# EAGLE schematic NGDash (EAGLE 9.2.1)

## Sheet 1 of 4
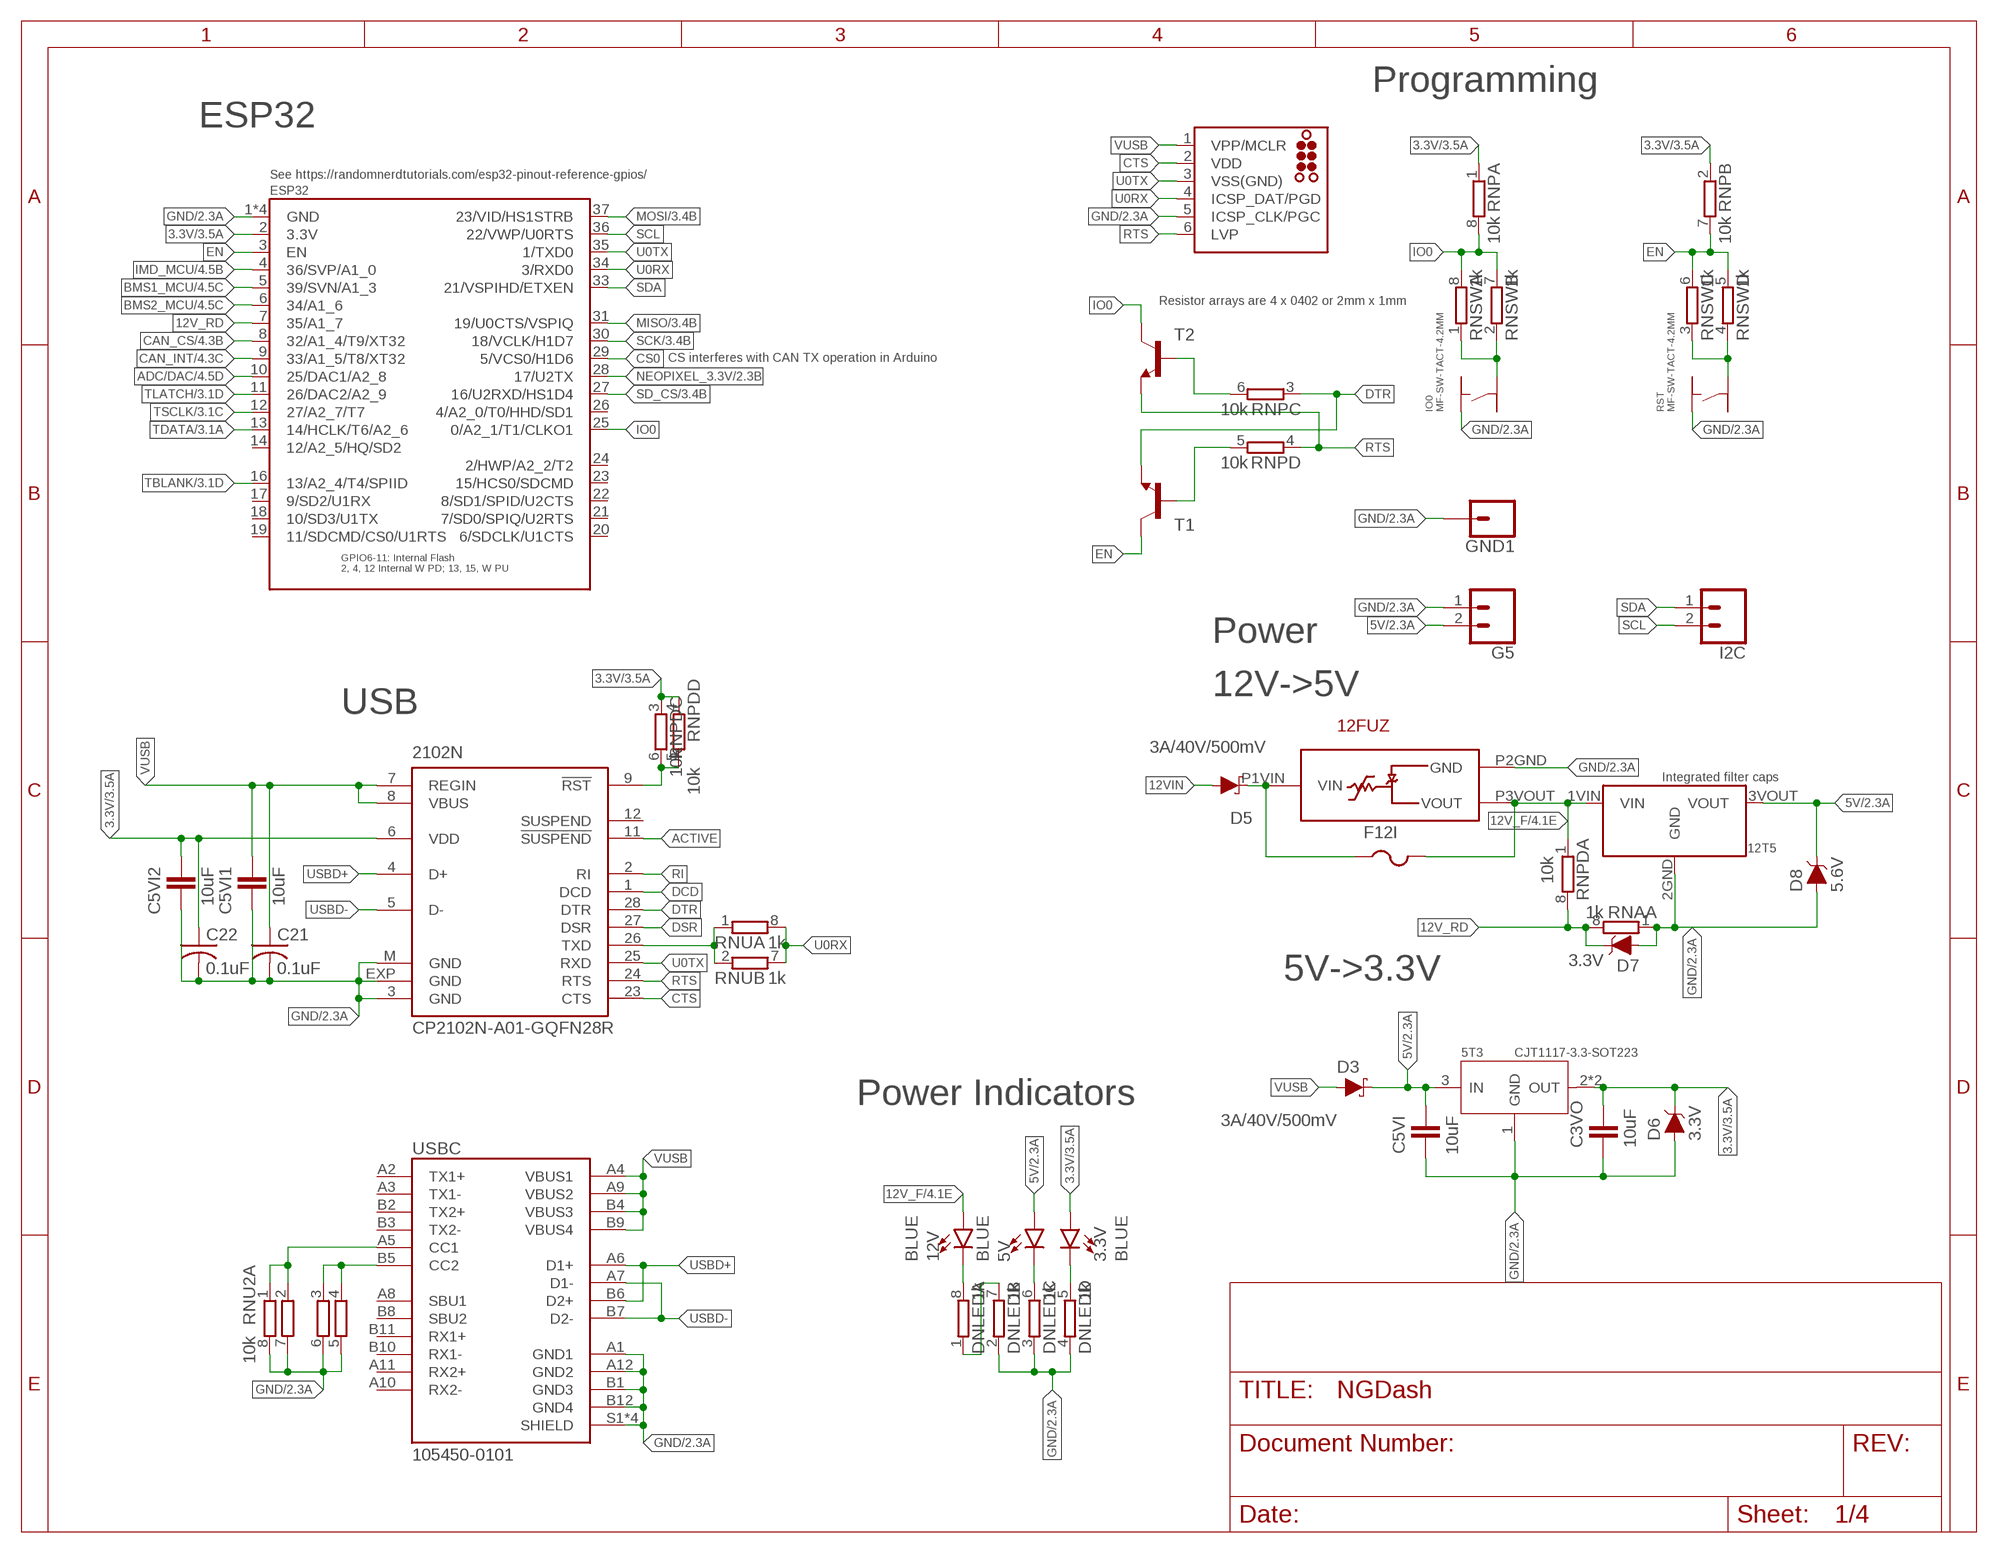
[diagram p0: schematic, sheet 1]

### Parts
3.3V  BLUE  LED-BLUE0603  [LED-0603]
5T3  CJT1117-3.3-SOT223  PMIC-CJT1117-3.3(SOT223)  [SOT-223]
5V  BLUE  LED-BLUE0603  [LED-0603]
12FUZ  LITTELFUSE-POLYZEN-ZEN164V130A24LS  [LITTELFUSE-POLYZEN-ZEN164V130A24LS]
12T5  TRACO-TSR-2-2450  [TRACO-TSR-2-2450]
12V  BLUE  LED-BLUE0603  [LED-0603]
2102N  CP2102N-A01-GQFN28R  CP2102  [MLP28]
C3VO  10uF  CAP1210  [1210]
C5VI  10uF  CAP1210  [1210]
C5VI1  10uF  CAP1210  [1210]
C5VI2  10uF  CAP1210  [1210]
C21  0.1uF  C-USC0603  [C0603]
C22  0.1uF  C-USC0603  [C0603]
D3  3A/40V/500mV  DIODE-SCHOTTKY-B340A  [SMA-DIODE]
D5  3A/40V/500mV  DIODE-SCHOTTKY-B340A  [SMA-DIODE]
D6  3.3V  DIODE-ZENER-MM3Z3V3T1G  [SOD-323]
D7  3.3V  DIODE-ZENER-MM3Z3V3T1G  [SOD-323]
D8  5.6V  DIODE-ZENER-MMSZ5232BS  [SOD-323]
DNLED  1k  4R-N0402ARV341  [4X0402ARV341]
ESP32  ESP32-WROOM-32  [ESP32-WROOM32]
F12I  PTCFUSE-1812  [1812]
G5  CONN_02  [1X02]
GND1  CONN_01  [1X01]
I2C  CONN_02  [1X02]
IO0  MF-SW-TACT-4.2MM  TACT_4.2MM  [TACT4.2MM]
J2  TC2030-MCP  [TC2030-MCP]
RNA  1k  4R-N0402ARV341  [4X0402ARV341]
RNP  10k  4R-N0402ARV341  [4X0402ARV341]
RNPD  10k  4R-N0402ARV341  [4X0402ARV341]
RNSW  1k  4R-N0402ARV341  [4X0402ARV341]
RNU  1k  4R-N0402ARV341  [4X0402ARV341]
RNU2  10k  4R-N0402ARV341  [4X0402ARV341]
RST  MF-SW-TACT-4.2MM  TACT_4.2MM  [TACT4.2MM]
T1  BC850-NPN-SOT23-BEC  [SOT23-BEC]
T2  BC850-NPN-SOT23-BEC  [SOT23-BEC]
USBC  105450-0101  [MOLEX_105450-0101]

### Nets
3.3V: 3.3V.A 5T3.2(OUT) 5T3.TER(OUT) 2102N.6(VDD) C3VO.1 C5VI2.1 C22.1 D6.C ESP32.2(3.3V) RNP.1 RNP.2 RNPD.3 RNPD.4 ; also sheet 3,4
5V: 5T3.3(IN) 5V.A 12T5.3VOUT(VOUT) C5VI.1 D3.C D8.C G5.2 ; also sheet 2,3,4
12V_F: 12FUZ.P3VOUT(VOUT) 12T5.1VIN(VIN) 12V.A F12I.2 RNPD.1 ; also sheet 4
12V_RD: D7.C ESP32.7(35/A1_7) RNA.8 RNPD.8
12VIN: D5.A ; also sheet 4
12VRECT: 12FUZ.P1VIN(VIN) D5.C F12I.1
ACTIVE: 2102N.11(!SUSPEND)
ADC/DAC: ESP32.10(25/DAC1/A2_8) ; also sheet 4
BMS1_MCU: ESP32.5(39/SVN/A1_3) ; also sheet 4
BMS2_MCU: ESP32.6(34/A1_6) ; also sheet 4
CAN_CS: ESP32.8(32/A1_4/T9/XT32) ; also sheet 4
CAN_INT: ESP32.9(33/A1_5/T8/XT32) ; also sheet 4
CS0: ESP32.29(5/VCS0/H1D6)
CTS: 2102N.23(CTS) J2.2(VDD)
DCD: 2102N.1(DCD)
DSR: 2102N.27(DSR)
DTR: 2102N.28(DTR) RNP.3 T1.E
EN: ESP32.3(EN) RNP.7 RNSW.5 RNSW.6 T1.C
GND: 5T3.1(GND) 12FUZ.P2GND(GND) 12T5.2GND(GND) 2102N.3(GND) 2102N.EXP(GND) 2102N.M(GND) C3VO.2 C5VI1.2 C5VI2.2 C5VI.2 C21.2 C22.2 D6.A D7.A D8.A DNLED.2 DNLED.3 DNLED.4 ESP32.1(GND) ESP32.15(GND) ESP32.38(GND) ESP32.GND G5.1 GND1.1 IO0.P$1 J2.5(ICSP_CLK/PGC) RNA.1 RNU2.5 RNU2.6 RNU2.7 RNU2.8 RST.P$1 USBC.A1(GND1) USBC.A12(GND2) USBC.B1(GND3) USBC.B12(GND4) USBC.S1(SHIELD) USBC.S2(SHIELD) USBC.S3(SHIELD) USBC.S4(SHIELD) ; also sheet 2,3,4
IMD_MCU: ESP32.4(36/SVP/A1_0) ; also sheet 4
IO0: ESP32.25(0/A2_1/T1/CLKO1) RNP.8 RNSW.7 RNSW.8 T2.C
MISO: ESP32.31(19/U0CTS/VSPIQ) ; also sheet 3,4
MOSI: ESP32.37(23/VID/HS1STRB) ; also sheet 3,4
N$1: 5V.C DNLED.6
N$2: IO0.P$4 RNSW.1 RNSW.2
N$3: RNP.5 T1.B
N$4: RNP.6 T2.B
N$6: RNU2.1 RNU2.2 USBC.A5(CC1)
N$7: RNSW.3 RNSW.4 RST.P$4
N$9: 3.3V.C DNLED.5
N$18: 2102N.9(!RST) RNPD.5 RNPD.6
N$19: RNU2.3 RNU2.4 USBC.B5(CC2)
N$104: DNLED.1 DNLED.7
N$110: 12V.C DNLED.8
NEOPIXEL_3.3V: ESP32.28(17/U2TX) ; also sheet 2
RI: 2102N.2(RI)
RTS: 2102N.24(RTS) J2.6(LVP) RNP.4 T2.E
SCK: ESP32.30(18/VCLK/H1D7) ; also sheet 3,4
SCL: ESP32.36(22/VWP/U0RTS) I2C.2
SD_CS: ESP32.27(16/U2RXD/HS1D4) ; also sheet 3
SDA: ESP32.33(21/VSPIHD/ETXEN) I2C.1
TBLANK: ESP32.16(13/A2_4/T4/SPIID) ; also sheet 3
TDATA: ESP32.13(14/HCLK/T6/A2_6) ; also sheet 3
TLATCH: ESP32.11(26/DAC2/A2_9) ; also sheet 3
TSCLK: ESP32.12(27/A2_7/T7) ; also sheet 3
U0RX: ESP32.34(3/RXD0) J2.4(ICSP_DAT/PGD) RNU.7 RNU.8
U0TX: 2102N.25(RXD) ESP32.35(1/TXD0) J2.3(VSS(GND))
U0TXC: 2102N.26(TXD) RNU.1 RNU.2
USBD+: 2102N.4(D+) USBC.A6(D1+) USBC.B6(D2+)
USBD-: 2102N.5(D-) USBC.A7(D1-) USBC.B7(D2-)
VUSB: 2102N.7(REGIN) 2102N.8(VBUS) C5VI1.1 C21.1 D3.A J2.1(VPP/MCLR) USBC.A4(VBUS1) USBC.A9(VBUS2) USBC.B4(VBUS3) USBC.B9(VBUS4)
Unconnected: 2102N.12(SUSPEND) ESP32.14(12/A2_5/HQ/SD2) ESP32.17(9/SD2/U1RX) ESP32.18(10/SD3/U1TX) ESP32.19(11/SDCMD/CS0/U1RTS) ESP32.20(6/SDCLK/U1CTS) ESP32.21(7/SD0/SPIQ/U2RTS) ESP32.22(8/SD1/SPID/U2CTS) ESP32.23(15/HCS0/SDCMD) ESP32.24(2/HWP/A2_2/T2) ESP32.26(4/A2_0/T0/HHD/SD1) IO0.P$2 IO0.P$3 RNPD.2 RNPD.7 RST.P$2 RST.P$3 USBC.A2(TX1+) USBC.A3(TX1-) USBC.A8(SBU1) USBC.A10(RX2-) USBC.A11(RX2+) USBC.B2(TX2+) USBC.B3(TX2-) USBC.B8(SBU2) USBC.B10(RX1-) USBC.B11(RX1+)

### Notes on the sheet
- Programming
- ESP32
- See https://randomnerdtutorials.com/esp32-pinout-reference-gpios/
- Resistor arrays are 4 x 0402 or 2mm x 1mm
- CS interferes with CAN TX operation in Arduino
- Power
- 12V->5V
- USB
- Integrated filter caps
- 5V->3.3V
- Power Indicators

## Sheet 2 of 4
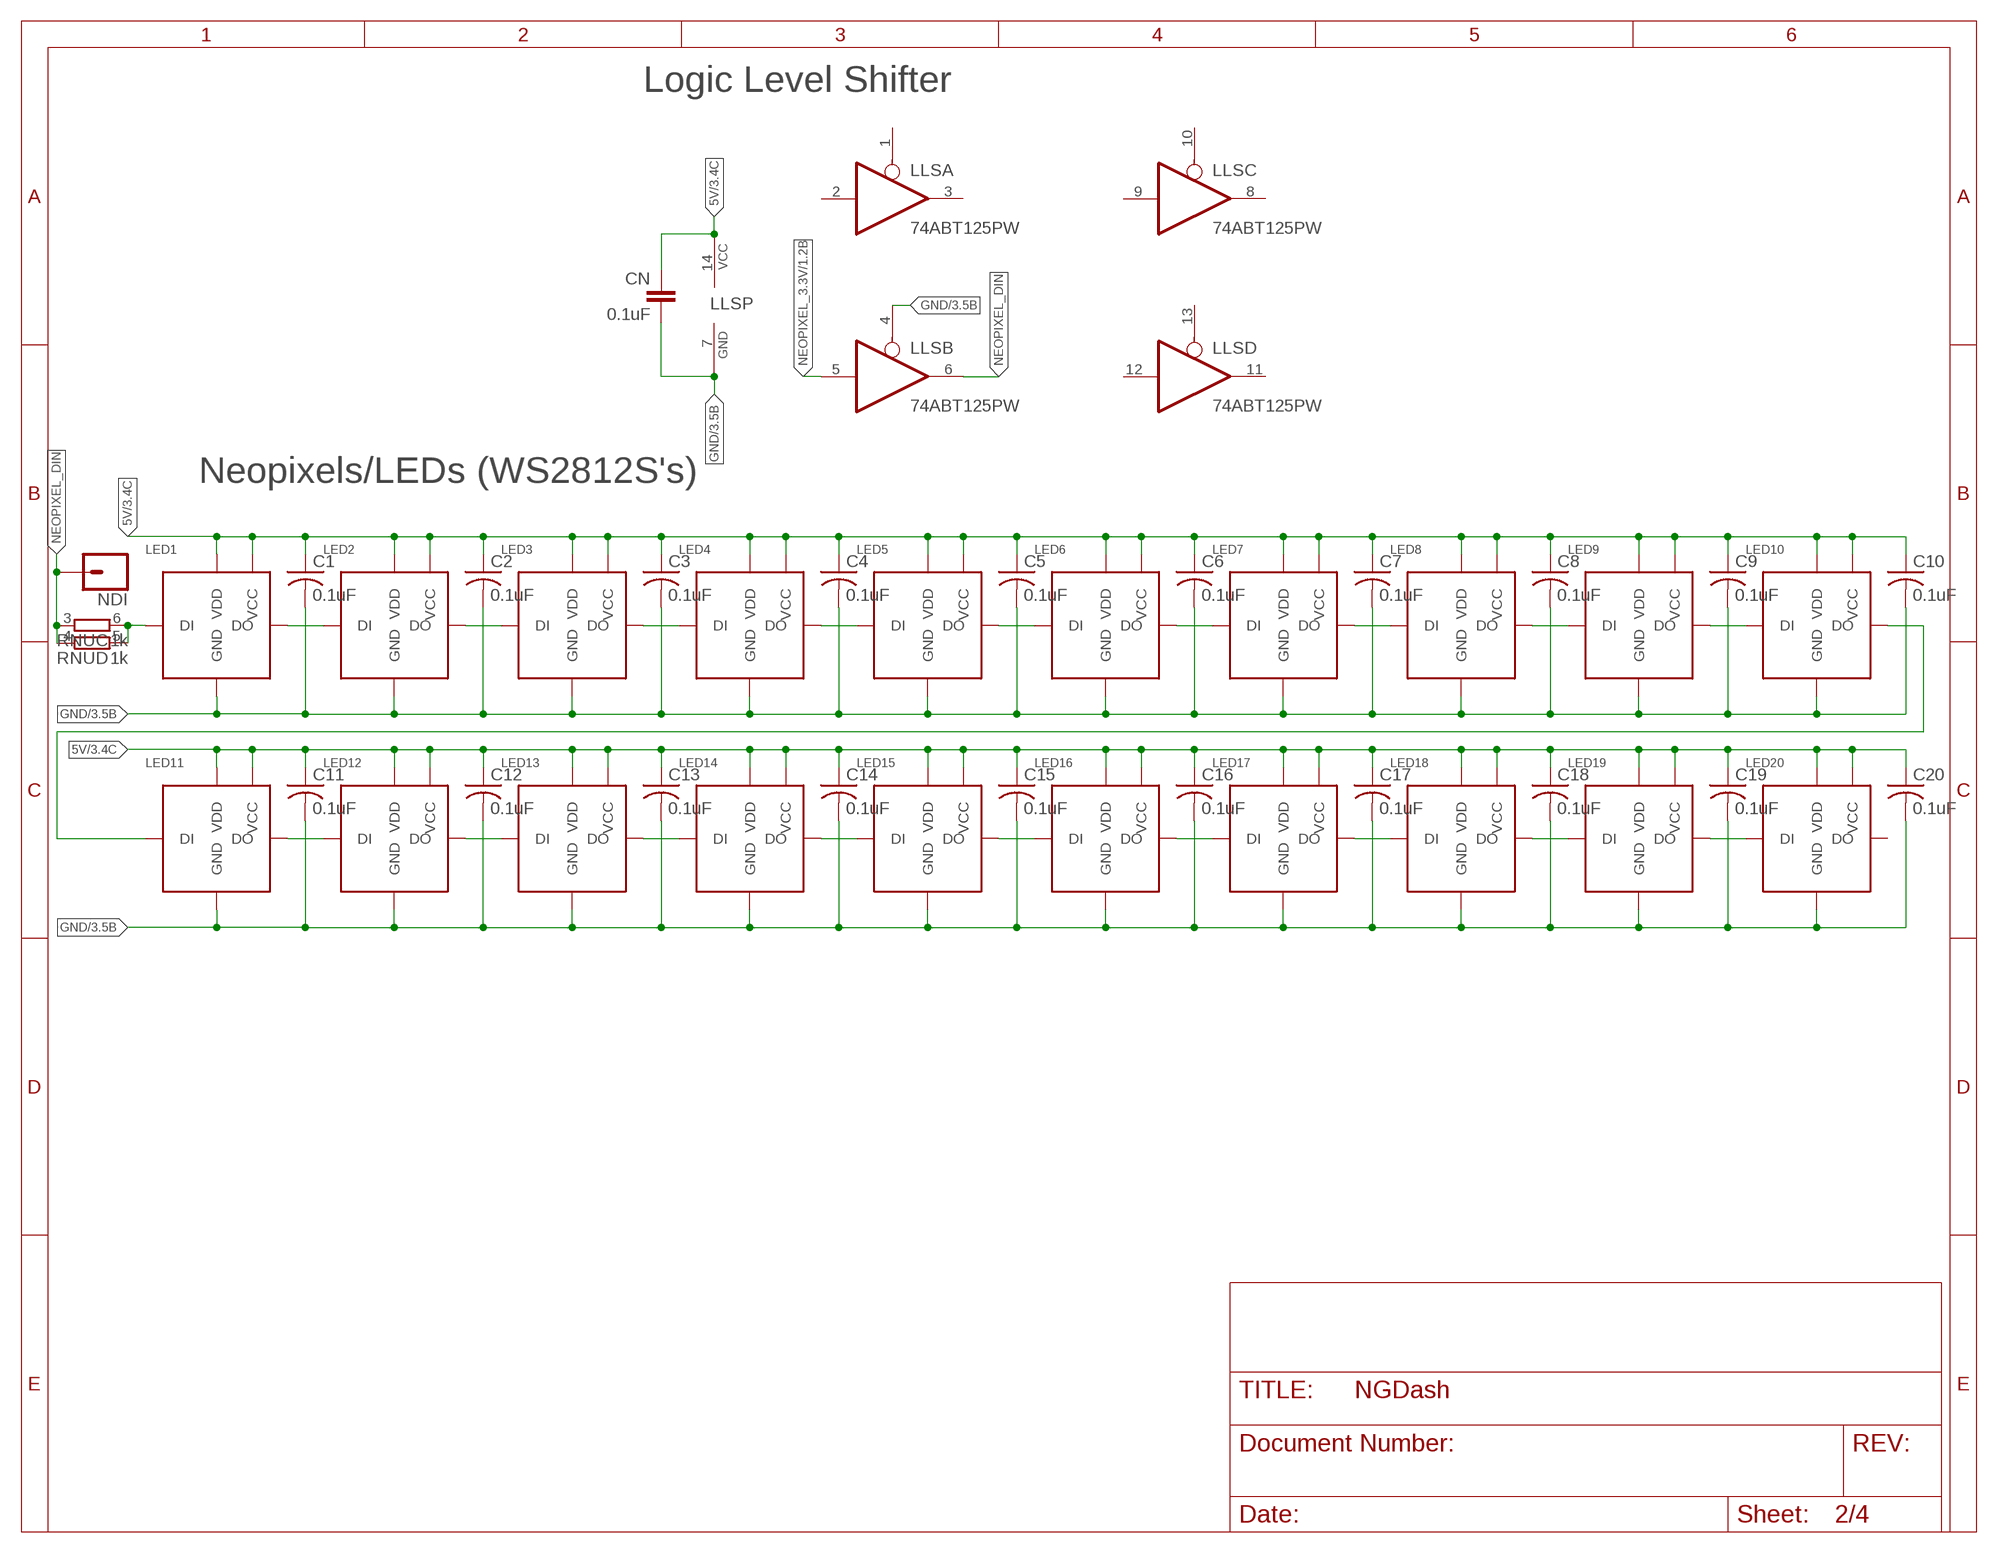
[diagram p1: schematic, sheet 2]

### Parts
C1  0.1uF  C-USC0603  [C0603]
C2  0.1uF  C-USC0603  [C0603]
C3  0.1uF  C-USC0603  [C0603]
C4  0.1uF  C-USC0603  [C0603]
C5  0.1uF  C-USC0603  [C0603]
C6  0.1uF  C-USC0603  [C0603]
C7  0.1uF  C-USC0603  [C0603]
C8  0.1uF  C-USC0603  [C0603]
C9  0.1uF  C-USC0603  [C0603]
C10  0.1uF  C-USC0603  [C0603]
C11  0.1uF  C-USC0603  [C0603]
C12  0.1uF  C-USC0603  [C0603]
C13  0.1uF  C-USC0603  [C0603]
C14  0.1uF  C-USC0603  [C0603]
C15  0.1uF  C-USC0603  [C0603]
C16  0.1uF  C-USC0603  [C0603]
C17  0.1uF  C-USC0603  [C0603]
C18  0.1uF  C-USC0603  [C0603]
C19  0.1uF  C-USC0603  [C0603]
C20  0.1uF  C-USC0603  [C0603]
CN  0.1uF  CAP0603-CAP  [0603-CAP]
LED1  WS2812S  [WS2812S5050]
LED2  WS2812S  [WS2812S5050]
LED3  WS2812S  [WS2812S5050]
LED4  WS2812S  [WS2812S5050]
LED5  WS2812S  [WS2812S5050]
LED6  WS2812S  [WS2812S5050]
LED7  WS2812S  [WS2812S5050]
LED8  WS2812S  [WS2812S5050]
LED9  WS2812S  [WS2812S5050]
LED10  WS2812S  [WS2812S5050]
LED11  WS2812S  [WS2812S5050]
LED12  WS2812S  [WS2812S5050]
LED13  WS2812S  [WS2812S5050]
LED14  WS2812S  [WS2812S5050]
LED15  WS2812S  [WS2812S5050]
LED16  WS2812S  [WS2812S5050]
LED17  WS2812S  [WS2812S5050]
LED18  WS2812S  [WS2812S5050]
LED19  WS2812S  [WS2812S5050]
LED20  WS2812S  [WS2812S5050]
LLS  74ABT125PW  [TSSOP14]
NDI  CONN_01  [1X01]

### Nets
5V: C1.1 C2.1 C3.1 C4.1 C5.1 C6.1 C7.1 C8.1 C9.1 C10.1 C11.1 C12.1 C13.1 C14.1 C15.1 C16.1 C17.1 C18.1 C19.1 C20.1 CN.1 LED1.3_FS_VCC(VCC) LED1.5_FS_5V(VDD) LED2.3_FS_VCC(VCC) LED2.5_FS_5V(VDD) LED3.3_FS_VCC(VCC) LED3.5_FS_5V(VDD) LED4.3_FS_VCC(VCC) LED4.5_FS_5V(VDD) LED5.3_FS_VCC(VCC) LED5.5_FS_5V(VDD) LED6.3_FS_VCC(VCC) LED6.5_FS_5V(VDD) LED7.3_FS_VCC(VCC) LED7.5_FS_5V(VDD) LED8.3_FS_VCC(VCC) LED8.5_FS_5V(VDD) LED9.3_FS_VCC(VCC) LED9.5_FS_5V(VDD) LED10.3_FS_VCC(VCC) LED10.5_FS_5V(VDD) LED11.3_FS_VCC(VCC) LED11.5_FS_5V(VDD) LED12.3_FS_VCC(VCC) LED12.5_FS_5V(VDD) LED13.3_FS_VCC(VCC) LED13.5_FS_5V(VDD) LED14.3_FS_VCC(VCC) LED14.5_FS_5V(VDD) LED15.3_FS_VCC(VCC) LED15.5_FS_5V(VDD) LED16.3_FS_VCC(VCC) LED16.5_FS_5V(VDD) LED17.3_FS_VCC(VCC) LED17.5_FS_5V(VDD) LED18.3_FS_VCC(VCC) LED18.5_FS_5V(VDD) LED19.3_FS_VCC(VCC) LED19.5_FS_5V(VDD) LED20.3_FS_VCC(VCC) LED20.5_FS_5V(VDD) LLS.14(P:VCC) ; also sheet 1,3,4
GND: C1.2 C2.2 C3.2 C4.2 C5.2 C6.2 C7.2 C8.2 C9.2 C10.2 C11.2 C12.2 C13.2 C14.2 C15.2 C16.2 C17.2 C18.2 C19.2 C20.2 CN.2 LED1.6_FS_GND(GND) LED2.6_FS_GND(GND) LED3.6_FS_GND(GND) LED4.6_FS_GND(GND) LED5.6_FS_GND(GND) LED6.6_FS_GND(GND) LED7.6_FS_GND(GND) LED8.6_FS_GND(GND) LED9.6_FS_GND(GND) LED10.6_FS_GND(GND) LED11.6_FS_GND(GND) LED12.6_FS_GND(GND) LED13.6_FS_GND(GND) LED14.6_FS_GND(GND) LED15.6_FS_GND(GND) LED16.6_FS_GND(GND) LED17.6_FS_GND(GND) LED18.6_FS_GND(GND) LED19.6_FS_GND(GND) LED20.6_FS_GND(GND) LLS.4(B:OE) LLS.7(P:GND) ; also sheet 1,3,4
N$5: LED1.1_FS_DO(DO) LED2.2_FS_DI(DI)
N$8: LED2.1_FS_DO(DO) LED3.2_FS_DI(DI)
N$10: LED3.1_FS_DO(DO) LED4.2_FS_DI(DI)
N$11: LED4.1_FS_DO(DO) LED5.2_FS_DI(DI)
N$12: LED5.1_FS_DO(DO) LED6.2_FS_DI(DI)
N$13: LED6.1_FS_DO(DO) LED7.2_FS_DI(DI)
N$14: LED7.1_FS_DO(DO) LED8.2_FS_DI(DI)
N$15: LED8.1_FS_DO(DO) LED9.2_FS_DI(DI)
N$16: LED9.1_FS_DO(DO) LED10.2_FS_DI(DI)
N$24: LED11.1_FS_DO(DO) LED12.2_FS_DI(DI)
N$25: LED12.1_FS_DO(DO) LED13.2_FS_DI(DI)
N$26: LED13.1_FS_DO(DO) LED14.2_FS_DI(DI)
N$27: LED14.1_FS_DO(DO) LED15.2_FS_DI(DI)
N$28: LED15.1_FS_DO(DO) LED16.2_FS_DI(DI)
N$29: LED16.1_FS_DO(DO) LED17.2_FS_DI(DI)
N$30: LED17.1_FS_DO(DO) LED18.2_FS_DI(DI)
N$31: LED18.1_FS_DO(DO) LED19.2_FS_DI(DI)
N$32: LED19.1_FS_DO(DO) LED20.2_FS_DI(DI)
N$160: LED1.2_FS_DI(DI) RNU.5 RNU.6
NDAT2: LED10.1_FS_DO(DO) LED11.2_FS_DI(DI)
NEOPIXEL_3.3V: LLS.5(B:I) ; also sheet 1
NEOPIXEL_DIN: LLS.6(B:O) NDI.1 RNU.3 RNU.4
Unconnected: LED20.1_FS_DO(DO) LLS.1(A:OE) LLS.2(A:I) LLS.3(A:O) LLS.8(C:O) LLS.9(C:I) LLS.10(C:OE) LLS.11(D:O) LLS.12(D:I) LLS.13(D:OE)

### Notes on the sheet
- Logic Level Shifter
- Neopixels/LEDs (WS2812S's)

## Sheet 3 of 4
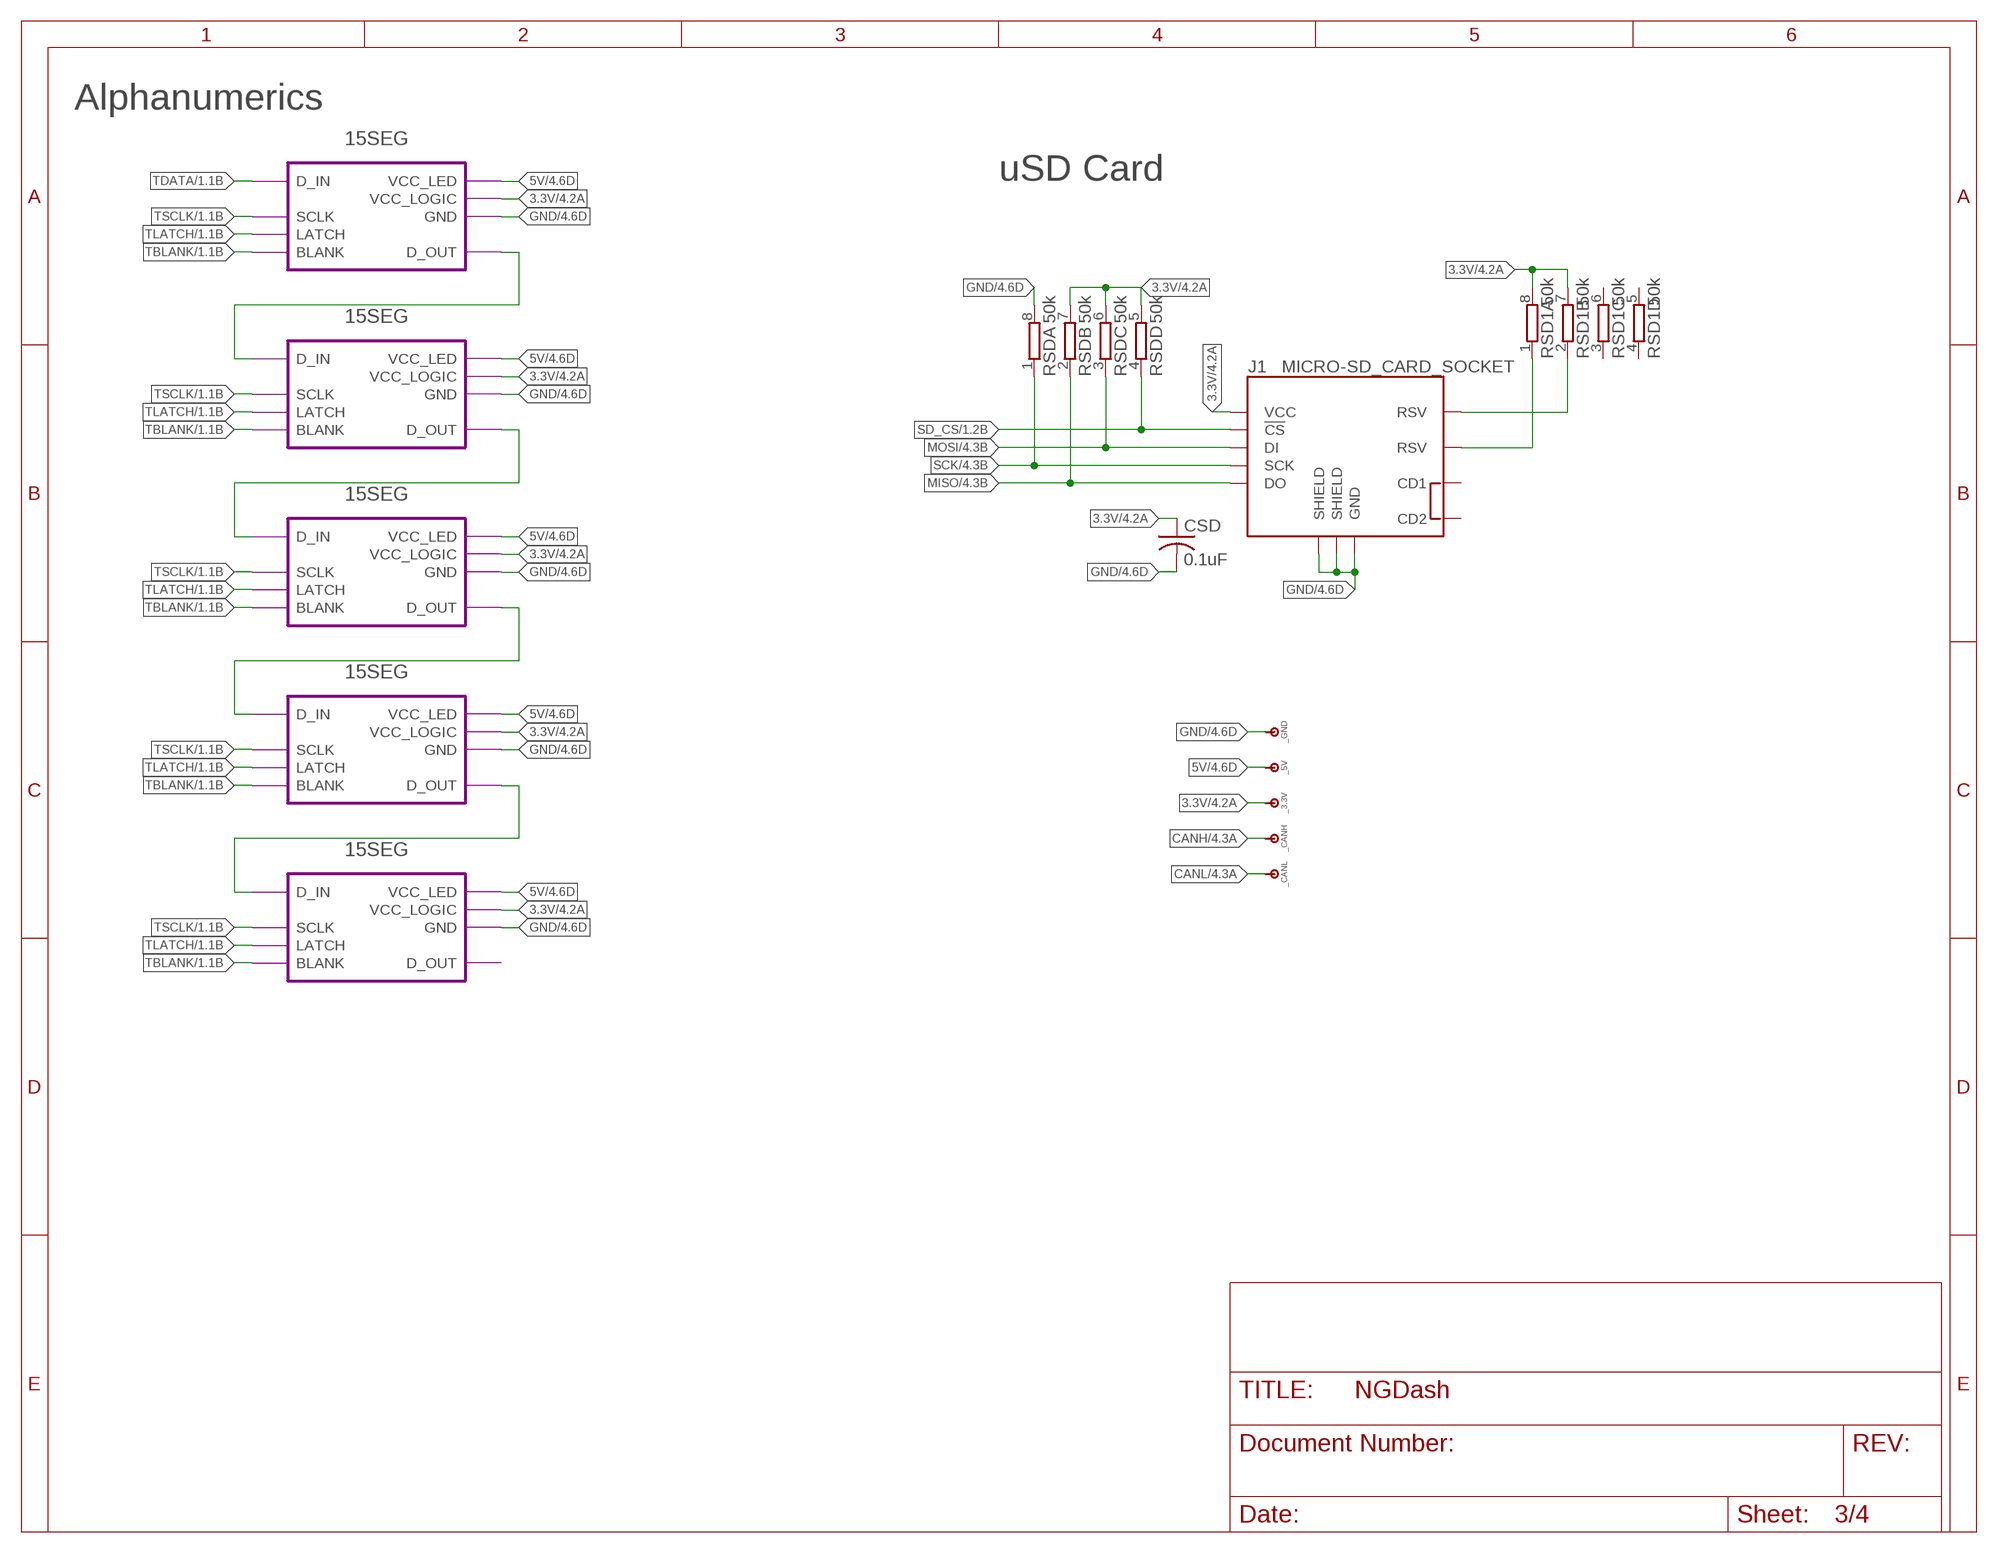
[diagram p2: schematic, sheet 3]

### Parts
_3.3V  TP  [TP]
_5V  TP  [TP]
_CANH  TP  [TP]
_CANL  TP  [TP]
_GND  TP  [TP]
CSD  0.1uF  C-USC0603  [C0603]
J1  MICRO-SD_CARD_SOCKET  [MICRO-SD-SOCKET]
RSD  50k  4R-N0402ARV341  [4X0402ARV341]
RSD1  50k  4R-N0402ARV341  [4X0402ARV341]

### Module instances
15SEG = 15SEGMENT
15SEG1 = 15SEGMENT
15SEG2 = 15SEGMENT
15SEG3 = 15SEGMENT
15SEG4 = 15SEGMENT

### Nets
3.3V: _3.3V.P$1 CSD.1 J1.VCC RSD1.7 RSD1.8 RSD.5 RSD.6 RSD.7 ; port 15SEG.VCC_LOGIC 15SEG1.VCC_LOGIC 15SEG2.VCC_LOGIC 15SEG3.VCC_LOGIC 15SEG4.VCC_LOGIC ; also sheet 1,4
5V: _5V.P$1 ; port 15SEG.VCC_LED 15SEG1.VCC_LED 15SEG2.VCC_LED 15SEG3.VCC_LED 15SEG4.VCC_LED ; also sheet 1,2,4
CANH: _CANH.P$1 ; also sheet 4
CANL: _CANL.P$1 ; also sheet 4
GND: _GND.P$1 CSD.2 J1.GND J1.GND1(SHIELD) J1.GND3(SHIELD) RSD.8 ; port 15SEG.GND 15SEG1.GND 15SEG2.GND 15SEG3.GND 15SEG4.GND ; also sheet 1,2,4
MISO: J1.DO RSD.2 ; also sheet 1,4
MOSI: J1.DI RSD.3 ; also sheet 1,4
N$17: J1.RSV1(RSV) RSD1.2
N$20: J1.RSV2(RSV) RSD1.1
N$116: port 15SEG.D_OUT 15SEG1.D_IN
N$117: port 15SEG1.D_OUT 15SEG2.D_IN
N$118: port 15SEG2.D_OUT 15SEG3.D_IN
N$119: port 15SEG3.D_OUT 15SEG4.D_IN
SCK: J1.SCLK(SCK) RSD.1 ; also sheet 1,4
SD_CS: J1.CS(!CS) RSD.4 ; also sheet 1
TBLANK: port 15SEG.BLANK 15SEG1.BLANK 15SEG2.BLANK 15SEG3.BLANK 15SEG4.BLANK ; also sheet 1
TDATA: port 15SEG.D_IN ; also sheet 1
TLATCH: port 15SEG.LATCH 15SEG1.LATCH 15SEG2.LATCH 15SEG3.LATCH 15SEG4.LATCH ; also sheet 1
TSCLK: port 15SEG.SCLK 15SEG1.SCLK 15SEG2.SCLK 15SEG3.SCLK 15SEG4.SCLK ; also sheet 1
Unconnected: J1.CD1 J1.CD2 RSD1.3 RSD1.4 RSD1.5 RSD1.6

### Notes on the sheet
- Alphanumerics
- uSD Card

## Sheet 4 of 4
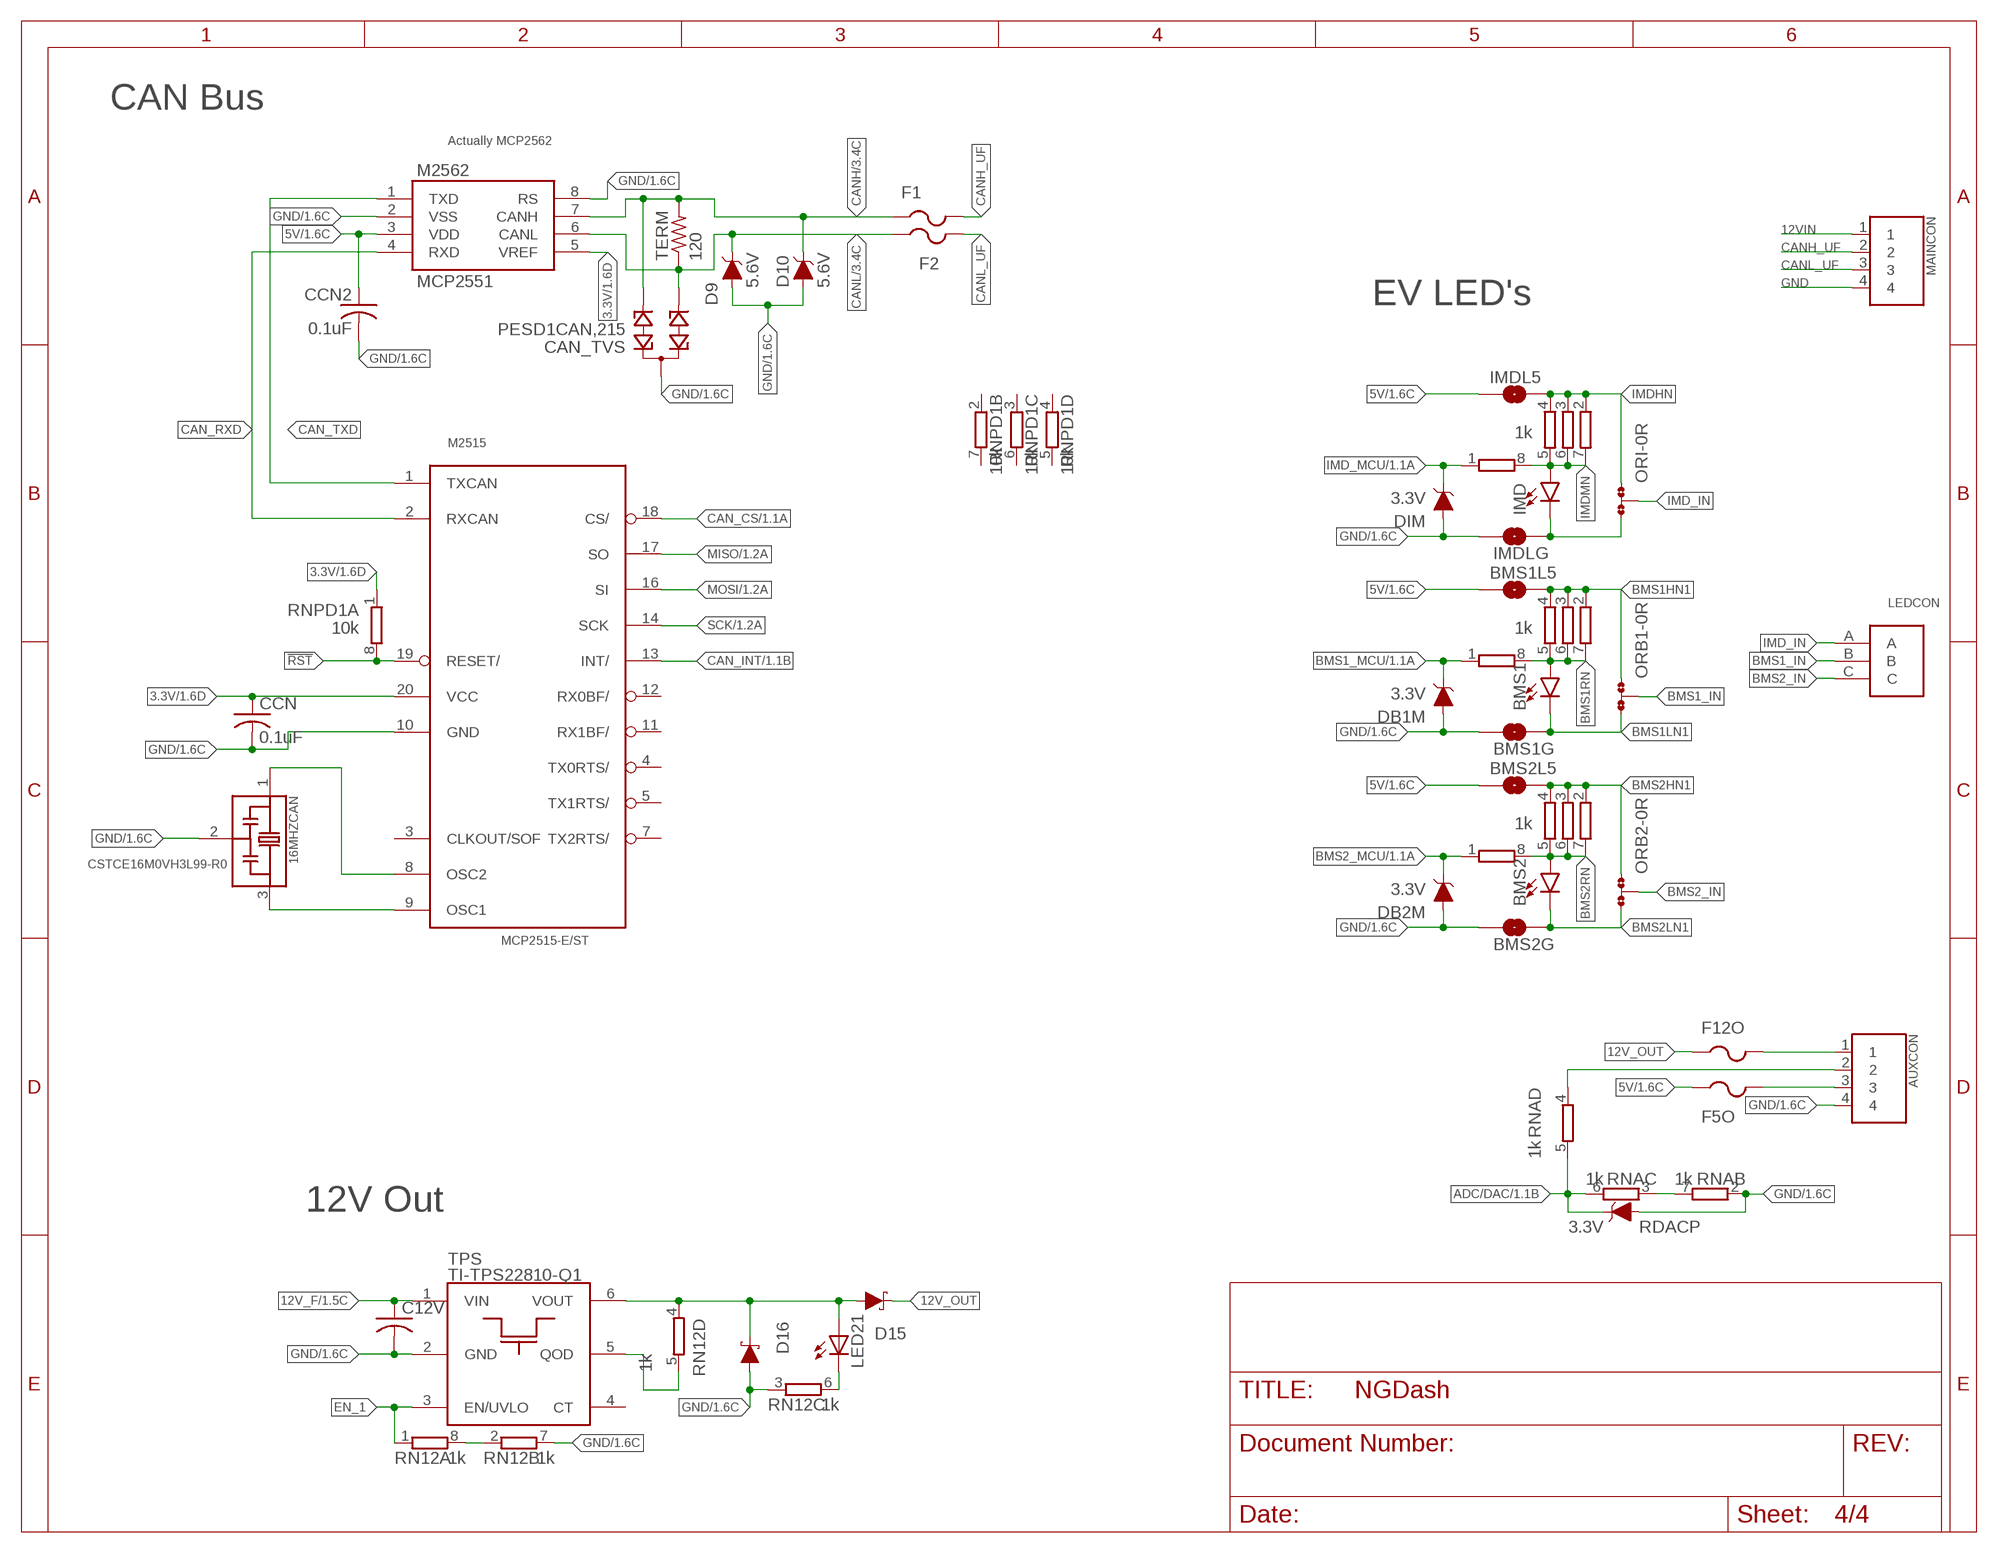
[diagram p3: schematic, sheet 4]

### Parts
16MHZCAN  CSTCE16M0VH3L99-R0  CSTCE16M0V53-R0  [OSC_CSTCE16M0V53-R0]
AUXCON  AMP-AT04-4P-BM02-DEUTSCH  [AMP-AT04-4P-BM02]
BMS1  LED1206  [LED-1206]
BMS1G  JUMPER-SMT_2_NO_SILK  [SMT-JUMPER_2_NO_SILK]
BMS1L5  JUMPER-SMT_2_NO_SILK  [SMT-JUMPER_2_NO_SILK]
BMS2  LED1206  [LED-1206]
BMS2G  JUMPER-SMT_2_NO_SILK  [SMT-JUMPER_2_NO_SILK]
BMS2L5  JUMPER-SMT_2_NO_SILK  [SMT-JUMPER_2_NO_SILK]
C12V  C-USC0603  [C0603]
CAN_TVS  PESD1CAN,215  PESD1CAN  [SOT23]
CCN  0.1uF  C-USC0603  [C0603]
CCN2  0.1uF  C-USC0603  [C0603]
D9  5.6V  DIODE-ZENER-MMSZ5232BS  [SOD-323]
D10  5.6V  DIODE-ZENER-MMSZ5232BS  [SOD-323]
D15  3A/40V/500mV  DIODE-SCHOTTKY-B340A  [SMA-DIODE]
D16  3A/40V/500mV  DIODE-SCHOTTKY-B340A  [SMA-DIODE]
DB1M  3.3V  DIODE-ZENER-MM3Z3V3T1G  [SOD-323]
DB2M  3.3V  DIODE-ZENER-MM3Z3V3T1G  [SOD-323]
DIM  3.3V  DIODE-ZENER-MM3Z3V3T1G  [SOD-323]
F1  PTCFUSE-1206  [R1206]
F2  PTCFUSE-1206  [R1206]
F5O  PTCFUSE-1206  [R1206]
F12O  PTCFUSE-1206  [R1206]
IMD  LED1206  [LED-1206]
IMDL5  JUMPER-SMT_2_NO_SILK  [SMT-JUMPER_2_NO_SILK]
IMDLG  JUMPER-SMT_2_NO_SILK  [SMT-JUMPER_2_NO_SILK]
LED21  LEDCHIP-LED0603  [CHIP-LED0603]
LEDCON  AMP-AT04-3P-BM02-DEUTSCH  [AMP-AT04-3P-BM02]
M2515  MCP2515-E/ST  MCP2515TSOP  [TSSOP20]
M2562  MCP2551  [SO08]
MAINCON  AMP-AT04-4P-BM02-DEUTSCH  [AMP-AT04-4P-BM02]
ORB1  0R-JUMPA  [A0R-JMP]
ORB2  0R-JUMPA  [A0R-JMP]
ORI  0R-JUMPA  [A0R-JMP]
RDACP  3.3V  DIODE-ZENER-MM3Z3V3T1G  [SOD-323]
RN12  1k  4R-N0402ARV341  [4X0402ARV341]
RNB1  1k  4R-N0402ARV341  [4X0402ARV341]
RNB2  1k  4R-N0402ARV341  [4X0402ARV341]
RNI  1k  4R-N0402ARV341  [4X0402ARV341]
RNPD1  10k  4R-N0402ARV341  [4X0402ARV341]
TERM  120  R-US_R0603  [R0603]
TPS  TI-TPS22810-Q1  [SOT23-6]

### Nets
3.3V: CCN.1 M2515.20(VCC) M2562.5(VREF) RNPD1.1 ; also sheet 1,3
5V: BMS1L5.1 BMS2L5.1 CCN2.1 F5O.1 IMDL5.1 M2562.3(VDD) ; also sheet 1,2,3
5VOFUSED: AUXCON.3 F5O.2
12V_F: C12V.1 TPS.1(VIN) ; also sheet 1
12V_OUT: D15.C F12O.1
12V_SW: D15.A D16.C LED21.A RN12.4 TPS.6(VOUT)
12VIN: MAINCON.1 ; also sheet 1
12VOFUSED: AUXCON.1 F12O.2
!RST: M2515.19(RESET/) RNPD1.8
ADC/DAC: RDACP.C RNA.5 RNA.6 ; also sheet 1
BMS1_IN: LEDCON.B ORB1.2
BMS1_MCU: DB1M.C RNB1.1 ; also sheet 1
BMS1HN1: BMS1L5.2 ORB1.1 RNB1.2 RNB1.3 RNB1.4
BMS1LN1: BMS1.C BMS1G.2 ORB1.3
BMS1RN: BMS1.A RNB1.5 RNB1.6 RNB1.7 RNB1.8
BMS2_IN: LEDCON.C ORB2.2
BMS2_MCU: DB2M.C RNB2.1 ; also sheet 1
BMS2HN1: BMS2L5.2 ORB2.1 RNB2.2 RNB2.3 RNB2.4
BMS2LN1: BMS2.C BMS2G.2 ORB2.3
BMS2RN: BMS2.A RNB2.5 RNB2.6 RNB2.7 RNB2.8
CAN_CS: M2515.18(CS/) ; also sheet 1
CAN_INT: M2515.13(INT/) ; also sheet 1
CAN_RXD: M2515.2(RXCAN) M2562.4(RXD)
CAN_TXD: M2515.1(TXCAN) M2562.1(TXD)
CANH: CAN_TVS.2 D10.C F1.1 M2562.7(CANH) TERM.2 ; also sheet 3
CANH_UF: F1.2 MAINCON.2
CANL: CAN_TVS.1 D9.C F2.1 M2562.6(CANL) TERM.1 ; also sheet 3
CANL_UF: F2.2 MAINCON.3
EN_1: RN12.1 TPS.3(EN/UVLO)
GND: 16MHZCAN.2 AUXCON.4 BMS1G.1 BMS2G.1 C12V.2 CAN_TVS.3 CCN2.2 CCN.2 D9.A D10.A D16.A DB1M.A DB2M.A DIM.A IMDLG.1 M2515.10(GND) M2562.2(VSS) M2562.8(RS) MAINCON.4 RDACP.A RN12.3 RN12.7 RNA.2 TPS.2(GND) ; also sheet 1,2,3
IMD_IN: LEDCON.A ORI.2
IMD_MCU: DIM.C RNI.1 ; also sheet 1
IMDHN: IMDL5.2 ORI.1 RNI.2 RNI.3 RNI.4
IMDLN: IMD.C IMDLG.2 ORI.3
IMDMN: IMD.A RNI.5 RNI.6 RNI.7 RNI.8
MCU_ADC/DAC: AUXCON.2 RNA.4
MISO: M2515.17(SO) ; also sheet 1,3
MOSI: M2515.16(SI) ; also sheet 1,3
N$102: 16MHZCAN.1 M2515.8(OSC2)
N$103: 16MHZCAN.3 M2515.9(OSC1)
N$111: LED21.C RN12.6
N$113: RNA.3 RNA.7
N$115: RN12.2 RN12.8
QOD1: RN12.5 TPS.5(QOD)
SCK: M2515.14(SCK) ; also sheet 1,3
Unconnected: M2515.3(CLKOUT/SOF) M2515.4(TX0RTS/) M2515.5(TX1RTS/) M2515.7(TX2RTS/) M2515.11(RX1BF/) M2515.12(RX0BF/) RNPD1.2 RNPD1.3 RNPD1.4 RNPD1.5 RNPD1.6 RNPD1.7 TPS.4(CT)

### Notes on the sheet
- CAN Bus
- Actually MCP2562
- EV LED's
- 12V Out

## Library data of the parts
3.3V 5V 12V = SparkFun-LED:LED-BLUE: Blue SMD LED Used in manufacturing of various products at SparkFun Packages: 0603 - SMD 0603 package [Product Link] <http://www.digikey.com/product-detail/en/SMLE12BC7TT86/511-1589-2-ND/1641808> 1206 - SMD1206 package [Product Link] <http://www.digikey.com/product-detail/en/lite-on-inc/LTST-C150TBKT/160-1643-1-ND/573584> SparkFun Products: ESP8266 Thing-Dev Board <https://www.sparkfun.com/products/13711> RedBoard <https://www.sparkfun.com/products/12757>; PROD_ID: DIO-08575
5T3 = Seeed-IC:PMIC-CJT1117-3.3(SOT223): 310030097; MPN: CJT1117-3.3
12FUZ = ClintonLib:LITTELFUSE-POLYZEN-ZEN164V130A24LS
12T5 = ClintonLib:TRACO-TSR-2-2450: Traco Linear Regulator Replacement/DC-DC Converter 6.5-36Vin 5V 2A Out 3-Pin Compact SIP -40-85C, 94% efficient, OCP, SCP Built-in filter capacitors Datasheet <https://www.tracopower.com/products/tsr2.pdf> Digikey <https://www.digikey.com/product-detail/en/traco-power/TSR-2-2450/1951-2692-ND/9383726>
16MHZCAN = CSTCE16M0V53-R0:CSTCE16M0V53-R0: 16MHz Ceramic Resonator Built in Capacitor 15pF ±0.3% -20°C ~ 80°C Surface Mount; AVAILABILITY: Good; DESCRIPTION: Ceramic Resonator 16MHz ??0.5% (Tol) ??0.3% (Stability) 15pF 40Ohm 3-Pin CSMD T/R; MF: Murata; MP: CSTCE16M0V53-R0; PACKAGE: None; PRICE: 0.30 USD
2102N = silabs:CP210*: Single-Chip USB to UART Bridge Source: www.silabs.com .. CP2101.pdf / cp2102.pdf; MF: FARNELL; MPN: CP2102-GM; OC_FARNELL: 9282130; OC_NEWARK: 30K5635
_3.3V _5V _CANH _CANL _GND = ClintonLib:TP: 1.25mm Test Point
AUXCON MAINCON = ClintonLib:AMP-AT04-4P-BM02-DEUTSCH
BMS1 BMS2 IMD = SparkFun-LED:LED: LED (Generic) Standard schematic elements and footprints for 5mm, 3mm, 1206, and 0603 sized LEDs. Generic LEDs with no color specified.
BMS1G BMS1L5 BMS2G BMS2L5 IMDL5 IMDLG = SparkFun-Jumpers:JUMPER-SMT_2_NO: Normally open jumper This jumper has two pads in close proximity to each other. Apply solder to close the connection. Round pads are easier to solder for beginners, but are a lot larger. SparkFun Product that uses the round pads: SparkFun EL Sequencer <https://www.sparkfun.com/products/12781>
C1-C22 = adafruit:C-US: CAPACITOR, American symbol
C3VO C5VI C5VI1 C5VI2 CN = SparkFun-Passives:CAP: Capacitor Standard 0603 ceramic capacitor, and 0.1" leaded capacitor.
C12V CCN CCN2 CSD = resistor:C-US: CAPACITOR, American symbol
CAN_TVS = diode:PESD1CAN: CAN bus ESD protection diode Source: http://www.nxp.com/documents/data_sheet/PESD1CAN.pdf
D3 D5 D15 D16 = SparkFun-DiscreteSemi:DIODE-SCHOTTKY: Schottky diode A Schottky diode is a semiconductor diode which has a low forward voltage drop and a very fast switching action.; PROD_ID: DIO-09886
D6 D7 DB1M DB2M DIM RDACP = SparkFun-DiscreteSemi:DIODE-ZENER: Zener Diode A Zener diode allows current to flow from its anode to its cathode like a normal semiconductor diode, but it also permits current to flow in the reverse direction when its "Zener voltage" is reached. - WIkipedia; PROD_ID: DIO-11284
D8-D10 = SparkFun-DiscreteSemi:DIODE-ZENER: Zener Diode A Zener diode allows current to flow from its anode to its cathode like a normal semiconductor diode, but it also permits current to flow in the reverse direction when its "Zener voltage" is reached. - WIkipedia; PROD_ID: DIO-12442
DNLED RN12 RNA RNB1 RNB2 RNI RNP RNPD RNPD1 RNSW RNU RNU2 RSD RSD1 = resistor-dil:4R-N: Array Chip Resistor Source: RS Component / Phycomp; OC_FARNELL: unknown; OC_NEWARK: unknown
ESP32 = ClintonLib:ESP32-WROOM-32: WiFi & Bluetooth/BLE SoM 2.7-3.6V, -40-80C, 4MB flash, 12b ADC, 8b DAC (IO 25, 26) (1.3MB Flash & 327kB RAM in Arduino) 80mA avg, 500mA PSU minimum, 0.1uF + 10uF caps recommended NOTE REQUIRED PIN STATES ON BOOT: IO 0 (Flash, DNU), IO 2 (Float, or low), IO 4 (Doesn't matter?), IO 5(High), IO 12 (Low), IO 15 (High) NOTE PINS HIGH ON BOOT: IO 1, 3, 5, 6-11, 14, 15 Datasheet <https://www.espressif.com/sites/default/files/documentation/esp32-wroom-32_datasheet_en.pdf> Digikey <https://www.digikey.com/product-detail/en/espressif-systems/ESP32-WROOM-32/1904-1010-1-ND/8544305> Mouser <https://www.mouser.com/ProductDetail/Espressif-Systems/ESP32-WROOM-32?qs=chTDxNqvsyltcwz%2FUUJDtQ%3D%3D>
F1 F2 F5O F12I F12O = adafruit:PTCFUSE: PTC fuses, resettable thermistors
G5 I2C = SparkFun-Connectors:CONN_02: Multi connection point. Often used as Generic Header-pin footprint for 0.1 inch spaced/style header connections On any of the 0.1 inch spaced packages, you can populate with these: Break Away Headers - Straight <https://www.sparkfun.com/products/116> (PRT-00116) Break Away Male Headers - Right Angle <https://www.sparkfun.com/products/553> (PRT-00553) Female Headers <https://www.sparkfun.com/products/115> (PRT-00115) Break Away Headers - Machine Pin <https://www.sparkfun.com/products/117> (PRT-00117) Break Away Female Headers - Swiss Machine Pin <https://www.sparkfun.com/products/743> (PRT-00743) For SCREWTERMINALS and SPRING TERMINALS visit here: Screw Terimnals on SparkFun.com <https://www.sparkfun.com/search/results?term=Screw+Terminals> (5mm/3.5mm/2.54mm spacing) This device is also useful as a general connection point to wire up your design to another part of your project. Our various solder wires solder well into these plated through hole pads. Hook-Up Wire - Assortment (Stranded, 22 AWG) <https://www.sparkfun.com/products/11375> (PRT-11375) Hook-Up Wire - Assortment (Solid Core, 22 AWG) <https://www.sparkfun.com/products/11367> (PRT-11367) View the entire wire category on our website here <https://www.sparkfun.com/categories/141> Special notes: Molex polarized connector foot print use with: PRT-08233 with associated crimp pins and housings. 2.54_SCREWTERM for use with PRT-10571. 3.5mm Screw Terminal footprints for PRT-08084 5mm Screw Terminal footprints for use with PRT-08432
GND1 NDI = SparkFun-Connectors:CONN_01: Single connection point. Often used as Generic Header-pin footprint for 0.1 inch spaced/style header connections On any of the 0.1 inch spaced packages, you can populate with these: Break Away Headers - Straight <https://www.sparkfun.com/products/116> (PRT-00116) Break Away Male Headers - Right Angle <https://www.sparkfun.com/products/553> (PRT-00553) Female Headers <https://www.sparkfun.com/products/115> (PRT-00115) Break Away Headers - Machine Pin <https://www.sparkfun.com/products/117> (PRT-00117) Break Away Female Headers - Swiss Machine Pin <https://www.sparkfun.com/products/743> (PRT-00743) This device is also useful as a general connection point to wire up your design to another part of your project. Our various solder wires solder well into these plated through hole pads. Hook-Up Wire - Assortment (Stranded, 22 AWG) <https://www.sparkfun.com/products/11375> (PRT-11375) Hook-Up Wire - Assortment (Solid Core, 22 AWG) <https://www.sparkfun.com/products/11367> (PRT-11367) View the entire wire category on our website here <https://www.sparkfun.com/categories/141> Special notes: SMTSO-256-ET is a "flush mount" nut for a 4-40 screw. We mostly use this on specialty testbeds; it is a nice way to connect hardware to your PCB at an adjustable hieght. Also note, the SNAP packages are for using a snappable style connector. We sell a baggie of snaps and they are also used on two LilyPad designs: Snap Assortment - 30 pack (male and female) <https://www.sparkfun.com/products/11347> (DEV-11347) LilyPad Arduino SimpleSnap <https://www.sparkfun.com/products/10941> (DEV-10941) LilyPad SimpleSnap Protoboard <https://www.sparkfun.com/products/10940> (DEV-10940)
IO0 RST = MF_Switches:TACT: Library: MF_Switches Description: Device for Tact Switches. Manufacture part number (MFG#) can be added via Attributes.; HOUSEPART: YES; MPN: MF-SW-TACT-4.2MM; POPULATE: 1; URL: https://factory.macrofab.com/part/MF-SW-TACT-4.2MM
J1 = SparkFun-Connectors:MICRO-SD_CARD_SOCKET: microSD Socket for Transflash Push-push type µSD socket. tDoc lines correctly indicate media card edge positions when inserting (unlocked, locked, depressed). NOTE: CD1 and CD2 are connected internally, and the default detect state of the socket is detect pin to ground. SparkFun Products: WAV Trigger <https://www.sparkfun.com/products/13660> CAN-Bus Shield <https://www.sparkfun.com/products/13262> SparkFun Level Shifing microSD Breakout <https://www.sparkfun.com/products/13743>; PROD_ID: CONN-07820; SF_ID: PRT-00127
J2 = tag-connect:TC2030: TAG-CONNECT ICSP Connector Manufacturer: Tag-Connect <http://www.tag-connect.com> Cable for easy In-Circuit Serial Programming. Designed for Microchip ICD2, suitable for many others. Two variants - one "with legs" (for hands-free fit on PCB) and another "without legs" for quick programming. PAD Description 1 MCLR/Vpp 2 Vdd 3 GND 4 PGD (ISPDAT) 5 PGC (ISPCLK) 6 nc (used for LVP) ©2009 ROFA.cz - modified and updated by Robert Darlington ‹rdarlington@gmail.com›
LED1-LED20 = ClintonLib:WS2812S: WS2812S
LED21 = adafruit:LED: LED OSRAM: - CHIPLED LG R971, LG N971, LY N971, LG Q971, LY Q971, LO R971, LY R971 LH N974, LH R974 LS Q976, LO Q976, LY Q976 LO Q996 - Hyper CHIPLED LW Q18S LB Q993, LB Q99A, LB R99A - SideLED LS A670, LO A670, LY A670, LG A670, LP A670 LB A673, LV A673, LT A673, LW A673 LH A674 LY A675 LS A676, LA A676, LO A676, LY A676, LW A676 LS A679, LY A679, LG A679 - Hyper Micro SIDELED® LS Y876, LA Y876, LO Y876, LY Y876 LT Y87S - SmartLED LW L88C, LW L88S LB L89C, LB L89S, LG L890 LS L89K, LO L89K, LY L89K LS L896, LA L896, LO L896, LY L896 - TOPLED LS T670, LO T670, LY T670, LG T670, LP T670 LSG T670, LSP T670, LSY T670, LOP T670, LYG T670 LG T671, LOG T671, LSG T671 LB T673, LV T673, LT T673, LW T673 LH T674 LS T676, LA T676, LO T676, LY T676, LB T676, LH T676, LSB T676, LW T676 LB T67C, LV T67C, LT T67C, LS T67K, LO T67K, LY T67K, LW E67C LS E67B, LA E67B, LO E67B, LY E67B, LB E67C, LV E67C, LT E67C LW T67C LS T679, LY T679, LG T679 LS T770, LO T770, LY T770, LG T770, LP T770 LB T773, LV T773, LT T773, LW T773 LH T774 LS E675, LA E675, LY E675, LS T675 LS T776, LA T776, LO T776, LY T776, LB T776 LHGB T686 LT T68C, LB T68C - Hyper Mini TOPLED® LB M676 - Mini TOPLED Santana® LG M470 LS M47K, LO M47K, LY M47K Source: http://www.osram.convergy.de/
LEDCON = ClintonLib:AMP-AT04-3P-BM02-DEUTSCH
LLS = 74xx-us:74*125: Quad bus BUFFER, 3-state
M2515 = MCP2515_MT:MCP2515*: MCP2515 Standalone CAN-Controller by Microchip Eagle-Lib. by MartinThomas
M2562 = SparkFun-IC-Comms:MCP2551: MCP2551 High Speed CAN Transceiver High speed CAN transceiver Datasheet <http://www.sparkfun.com/datasheets/DevTools/Arduino/MCP2551.pdf> SparkFun Products CAN-BUS Shield <https://www.sparkfun.com/products/13262> (DEV-13262) SparkFun OBD-II UART <https://www.sparkfun.com/products/9555> (WIG-09555); PROD_ID: IC-09907
ORB1 ORB2 ORI = jump-0r-smd:0R-JUMP: SMD 0R 0805 Jumper
T1 T2 = transistor:*-NPN-: NPN Transistror BF959 corrected 2008.03.06
TERM = resistor:R-US_: RESISTOR, American symbol
TPS = ClintonLib:TI-TPS22810-Q1: 2A, 2.7-18V, 79mOhm load switch with thermal protection, SOT23-6 Datasheet <http://www.ti.com/lit/ds/symlink/tps22810-q1.pdf> Digikey <https://www.digikey.com/product-detail/en/texas-instruments/TPS22810TDBVRQ1/296-50496-1-ND/9685635>
USBC = 105450-0101:105450-0101: USB Shielded I/O Receptacle; Type C; Right Angle; Surface Mount; Gold over Nickel; AVAILABILITY: Unavailable; DESCRIPTION: USB Shielded I/O Receptacle; Type C; Right Angle; Surface Mount; Gold over Nickel; MF: Molex; MP: 1054500101; PACKAGE: None; PRICE: None

## Module 15SEGMENT
Ports: VCC_LED(pwr) VCC_LOGIC(pwr) GND(pwr) SCLK(io) D_IN(io) D_OUT(out) LATCH(io) BLANK(io)
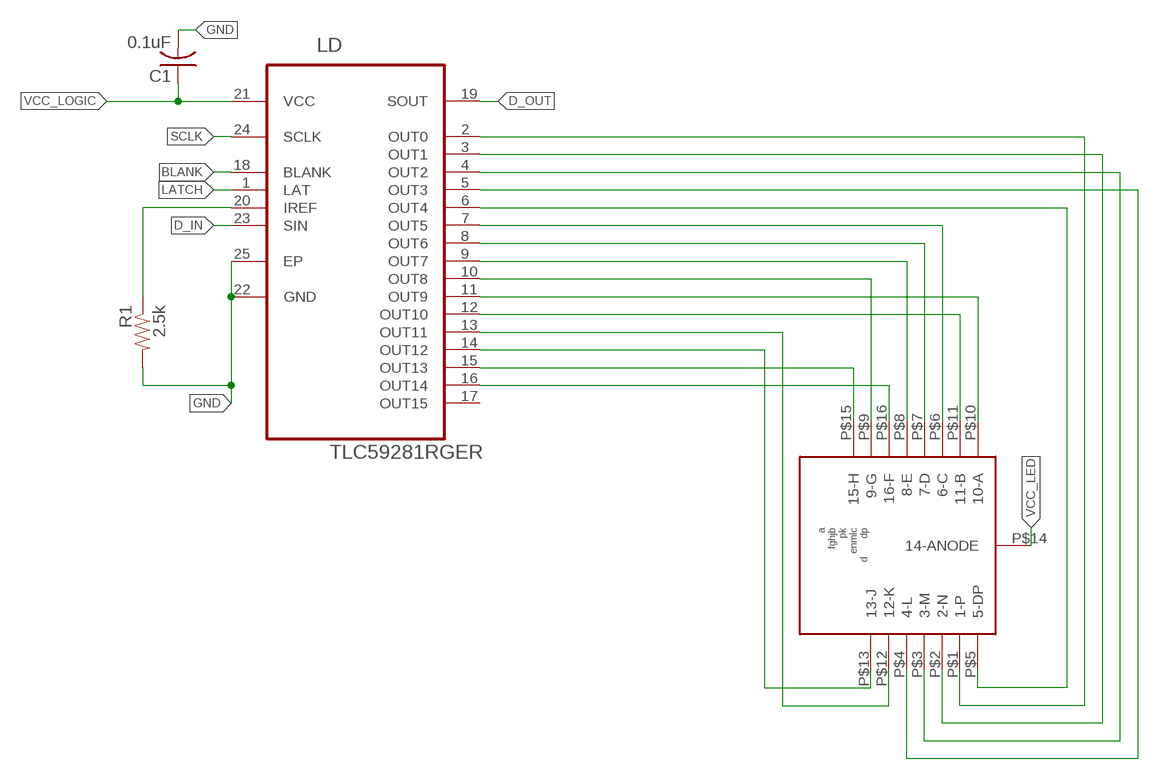
[diagram p4: schematic, module 15SEGMENT, sheet 1]

### Parts
AN  ACPSA04-41SYKWA  [ACPSA04-41SYKWA]
C1  0.1uF  C-USC0603K  [C0603K]
LD  TLC59281RGER  [QFN50P400X400X100-25N]
R1  2.5k  RESISTOR0603-RES  [0603-RES]

### Nets
BLANK: LD.18(BLANK)
D_IN: LD.23(SIN)
D_OUT: LD.19(SOUT)
GND: C1.2 LD.22(GND) LD.25(EP) R1.2
LATCH: LD.1(LAT)
N$1: LD.20(IREF) R1.1
N$2 [alphanumeric]: AN.P$1(1-P) LD.2(OUT0)
N$3 [alphanumeric]: AN.P$2(2-N) LD.3(OUT1)
N$4 [alphanumeric]: AN.P$3(3-M) LD.4(OUT2)
N$5 [alphanumeric]: AN.P$4(4-L) LD.5(OUT3)
N$6 [alphanumeric]: AN.P$5(5-DP) LD.6(OUT4)
N$7 [alphanumeric]: AN.P$6(6-C) LD.7(OUT5)
N$8 [alphanumeric]: AN.P$7(7-D) LD.8(OUT6)
N$9 [alphanumeric]: AN.P$8(8-E) LD.9(OUT7)
N$10 [alphanumeric]: AN.P$9(9-G) LD.10(OUT8)
N$11 [alphanumeric]: AN.P$10(10-A) LD.11(OUT9)
N$12 [alphanumeric]: AN.P$11(11-B) LD.12(OUT10)
N$13 [alphanumeric]: AN.P$12(12-K) LD.13(OUT11)
N$14 [alphanumeric]: AN.P$13(13-J) LD.14(OUT12)
N$15 [alphanumeric]: AN.P$15(15-H) LD.15(OUT13)
N$16 [alphanumeric]: AN.P$16(16-F) LD.16(OUT14)
SCLK: LD.24(SCLK)
VCC_LED: AN.P$14(14-ANODE)
VCC_LOGIC: C1.1 LD.21(VCC)
Unconnected: LD.17(OUT15)

### Library data of the parts
AN = ClintonLib:ACPSA04-41SYKWA
C1 = resistor:C-US: CAPACITOR, American symbol
LD = Texas Instruments_By_element14_Batch_1:TLC59281RGER: 16-Channel, Constant-Current LED Driver; MPN: TLC59281RGER; OC_FARNELL: -; OC_NEWARK: 72R6575; PACKAGE: VQFN-24; SUPPLIER: Texas Instruments
R1 = SparkFun-Passives:RESISTOR: Resistor Basic schematic elements and footprints for 0603, 1206, and PTH resistors.

## Net classes
0 default: width 0.152 mm
1 alphanumeric: width 0.127 mm
5 8mil: width 0.203 mm, drill 0.305 mm, clearance 0.064 mm